# Altium project FMC_Delay_1ns_4Cha.PrjPcb (part 1 of 3)
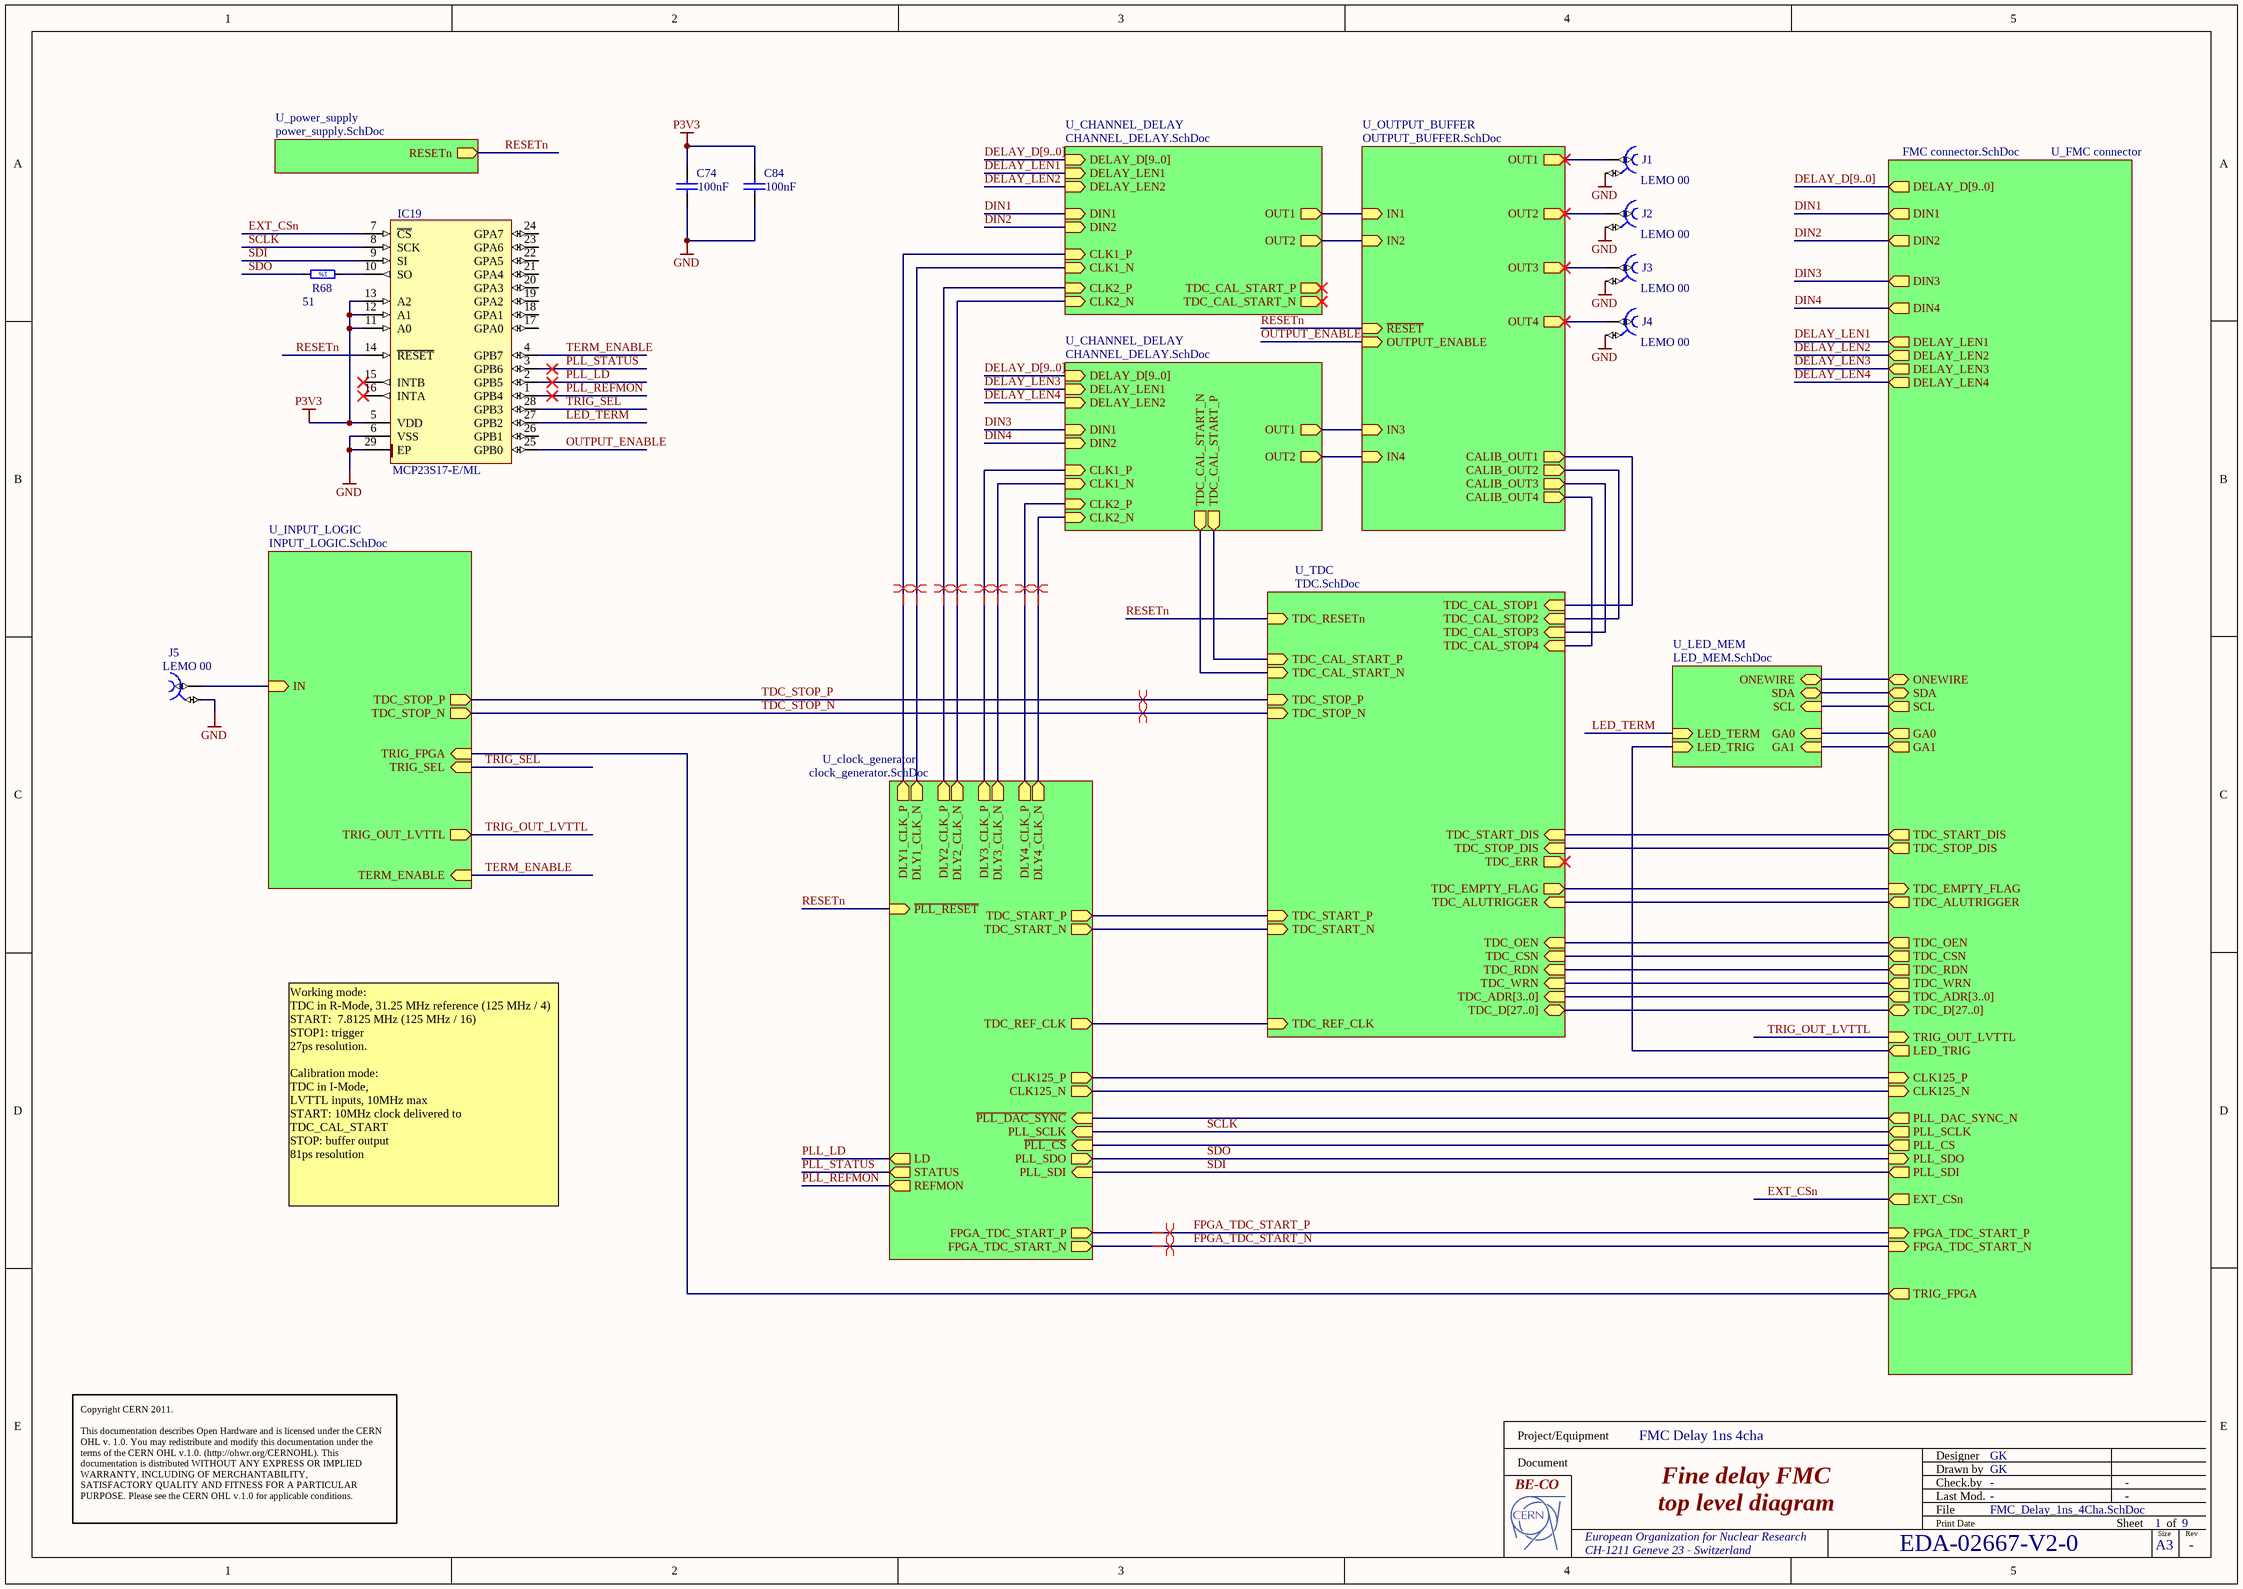
[diagram p0: FMC_Delay_1ns_4Cha.SchDoc]
9 sheets, 250 parts. Net scope: hierarchical (ports join the sheet entries above them; power ports are global).
Board file: FMC_Delay_1ns_4Cha.PcbDoc
Sheets:
  FMC_Delay_1ns_4Cha.SchDoc
    U_clock_generator = clock_generator.SchDoc
    U_FMC connector = FMC connector.SchDoc
    U_power_supply = power_supply.SchDoc
    U_TDC = TDC.SchDoc
    U_CHANNEL_DELAY = CHANNEL_DELAY.SchDoc
    U_CHANNEL_DELAY = CHANNEL_DELAY.SchDoc
    U_OUTPUT_BUFFER = OUTPUT_BUFFER.SchDoc
    U_INPUT_LOGIC = INPUT_LOGIC.SchDoc
    U_LED_MEM = LED_MEM.SchDoc

## Sheet FMC_Delay_1ns_4Cha.SchDoc: Fine delay FMC
size 420 x 297 mm; CheckedBy: -; CompanyName: CERN; DrawnBy: GK; Organization: CERN; Address1: European Organization for Nuclear Research; Address2: CH-1211 Geneve 23 - Switzerland; Revision: -; SheetNumber: 1; SheetTotal: 9; EDA_Number: EDA-02667-V2-0; Projet: FMC Delay 1ns 4cha; ModifiedBy: -; CheckedDate: -; Title2: top level diagram; DivGrp: BE-CO; Designer: GK; ModifiedDate: -; ProjectName: FMC Delay 1ns 4cha

### Parts
C74  100nF  [CAPC1608X87N]
C84  100nF  [CAPC1608X87N]
IC19  MCP23S17-E/ML  [QFN65P600X600X100-29N-S420]
J1  LEMO 00  [LEMO_EPL.00.250.NTN]
J2  LEMO 00  [LEMO_EPL.00.250.NTN]
J3  LEMO 00  [LEMO_EPL.00.250.NTN]
J4  LEMO 00  [LEMO_EPL.00.250.NTN]
J5  LEMO 00  [LEMO_EPL.00.250.NTN]
R68  51  [RESC1608X55N]

### Sub-sheets
U_CHANNEL_DELAY = CHANNEL_DELAY.SchDoc: DELAY_D[9..0] (in), DELAY_LEN1 (in), DELAY_LEN2 (in), DIN1 (in), DIN2 (in), OUT1 (out), OUT2 (out), TDC_CAL_START_P (out), TDC_CAL_START_N (out), CLK1_P (in), CLK1_N (in), CLK2_N (in), CLK2_P (in)
U_CHANNEL_DELAY = CHANNEL_DELAY.SchDoc: DELAY_D[9..0] (in), DELAY_LEN1 (in), DELAY_LEN2 (in), DIN1 (in), DIN2 (in), OUT1 (out), OUT2 (out), TDC_CAL_START_P (out), TDC_CAL_START_N (out), CLK1_P (in), CLK1_N (in), CLK2_N (in), CLK2_P (in)
U_clock_generator = clock_generator.SchDoc: PLL_SCLK (in), PLL_SDO (out), PLL_SDI (in), TDC_REF_CLK (out), CLK125_N (out), CLK125_P (out), LD (out), STATUS (out), REFMON (out), DLY1_CLK_P (out), DLY1_CLK_N (out), DLY2_CLK_P (out), DLY2_CLK_N (out), DLY3_CLK_P (out), DLY3_CLK_N (out), DLY4_CLK_P (out), DLY4_CLK_N (out), ~{PLL_CS} (in), ~{PLL_RESET} (in), ~{PLL_DAC_SYNC} (in), TDC_START_P (out), TDC_START_N (out), FPGA_TDC_START_N (out), FPGA_TDC_START_P (out)
U_FMC connector = FMC connector.SchDoc: DIN1 (out), DIN2 (out), DIN3 (out), DIN4 (out), TDC_START_DIS (out), TDC_STOP_DIS (out), TDC_EMPTY_FLAG (in), TDC_CSN (out), TDC_RDN (out), TDC_WRN (out), TDC_ADR[3..0] (out), TDC_D[27..0] (bidir), DELAY_LEN1 (out), DELAY_LEN2 (out), DELAY_LEN3 (out), DELAY_LEN4 (out), PLL_SCLK (out), PLL_CS (out), PLL_SDO (in), PLL_SDI (out), CLK125_P (in), CLK125_N (in), TRIG_OUT_LVTTL (in), DELAY_D[9..0] (out), TRIG_FPGA (out), SDA (bidir), SCL (out), GA0 (out), GA1 (out), EXT_CSn (out), PLL_DAC_SYNC_N (out), TDC_OEN (out), TDC_ALUTRIGGER (out), FPGA_TDC_START_N (in), FPGA_TDC_START_P (in), ONEWIRE (bidir), LED_TRIG (out)
U_INPUT_LOGIC = INPUT_LOGIC.SchDoc: IN (in), TERM_ENABLE (in), TRIG_OUT_LVTTL (out), TRIG_FPGA (in), TRIG_SEL (in), TDC_STOP_P (out), TDC_STOP_N (out)
U_LED_MEM = LED_MEM.SchDoc: SDA (bidir), SCL (in), GA0 (in), GA1 (in), ONEWIRE (bidir), LED_TERM (in), LED_TRIG (in)
U_OUTPUT_BUFFER = OUTPUT_BUFFER.SchDoc: IN1 (in), IN2 (in), IN3 (in), IN4 (in), OUT1 (out), OUT2 (out), OUT3 (out), OUT4 (out), ~{RESET} (in), CALIB_OUT1 (out), CALIB_OUT2 (out), CALIB_OUT3 (out), CALIB_OUT4 (out), OUTPUT_ENABLE (in)
U_power_supply = power_supply.SchDoc: RESETn (out)
U_TDC = TDC.SchDoc: TDC_ADR[3..0] (in), TDC_START_P (in), TDC_START_N (in), TDC_CAL_STOP1 (in), TDC_CAL_STOP2 (in), TDC_CAL_STOP3 (in), TDC_CAL_STOP4 (in), TDC_START_DIS (in), TDC_STOP_DIS (in), TDC_EMPTY_FLAG (out), TDC_REF_CLK (in), TDC_RESETn (in), TDC_D[27..0] (bidir), TDC_OEN (in), TDC_CSN (in), TDC_RDN (in), TDC_WRN (in), TDC_CAL_START_N (in), TDC_CAL_START_P (in), TDC_ERR (out), TDC_STOP_P (in), TDC_STOP_N (in), TDC_ALUTRIGGER (in)

### Nets
GND: C74.2 C84.2 IC19.6(VSS) IC19.29(EP) J1.2 J2.2 J3.2 J4.2 J5.2
P3V3: C74.1 C84.1 IC19.5(VDD) IC19.11(A0) IC19.12(A1) IC19.13(A2)
CLK1_N: sheet U_clock_generator/DLY1_CLK_N, sheet U_CHANNEL_DELAY/CLK1_N
CLK1_N: sheet U_clock_generator/DLY3_CLK_N, sheet U_CHANNEL_DELAY/CLK1_N  [a separate net that carries the same name]
CLK1_P: sheet U_clock_generator/DLY1_CLK_P, sheet U_CHANNEL_DELAY/CLK1_P
CLK1_P: sheet U_clock_generator/DLY3_CLK_P, sheet U_CHANNEL_DELAY/CLK1_P  [a separate net that carries the same name]
CLK2_N: sheet U_clock_generator/DLY2_CLK_N, sheet U_CHANNEL_DELAY/CLK2_N
CLK2_N: sheet U_clock_generator/DLY4_CLK_N, sheet U_CHANNEL_DELAY/CLK2_N  [a separate net that carries the same name]
CLK2_P: sheet U_clock_generator/DLY2_CLK_P, sheet U_CHANNEL_DELAY/CLK2_P
CLK2_P: sheet U_clock_generator/DLY4_CLK_P, sheet U_CHANNEL_DELAY/CLK2_P  [a separate net that carries the same name]
CLK125_N: sheet U_clock_generator/CLK125_N, sheet U_FMC connector/CLK125_N
CLK125_P: sheet U_clock_generator/CLK125_P, sheet U_FMC connector/CLK125_P
D1_N: sheet U_TDC/TDC_CAL_START_N, sheet U_CHANNEL_DELAY/TDC_CAL_START_N
D1_P: sheet U_TDC/TDC_CAL_START_P, sheet U_CHANNEL_DELAY/TDC_CAL_START_P
DELAY_LEN1: sheet U_FMC connector/DELAY_LEN1, sheet U_CHANNEL_DELAY/DELAY_LEN1
DELAY_LEN2: sheet U_FMC connector/DELAY_LEN2, sheet U_CHANNEL_DELAY/DELAY_LEN2
DELAY_LEN3: sheet U_FMC connector/DELAY_LEN3, sheet U_CHANNEL_DELAY/DELAY_LEN1
DELAY_LEN4: sheet U_FMC connector/DELAY_LEN4, sheet U_CHANNEL_DELAY/DELAY_LEN2
DIN1: sheet U_FMC connector/DIN1, sheet U_CHANNEL_DELAY/DIN1
DIN2: sheet U_FMC connector/DIN2, sheet U_CHANNEL_DELAY/DIN2
DIN3: sheet U_FMC connector/DIN3, sheet U_CHANNEL_DELAY/DIN1
DIN4: sheet U_FMC connector/DIN4, sheet U_CHANNEL_DELAY/DIN2
EXT_CSn: IC19.7(~{CS}) ; sheet U_FMC connector/EXT_CSn
FPGA_TDC_START_N: sheet U_clock_generator/FPGA_TDC_START_N, sheet U_FMC connector/FPGA_TDC_START_N
FPGA_TDC_START_P: sheet U_clock_generator/FPGA_TDC_START_P, sheet U_FMC connector/FPGA_TDC_START_P
GA0: sheet U_FMC connector/GA0, sheet U_LED_MEM/GA0
GA1: sheet U_FMC connector/GA1, sheet U_LED_MEM/GA1
LED_TERM: IC19.27(GPB2) ; sheet U_LED_MEM/LED_TERM
OUTPUT_ENABLE: IC19.25(GPB0) ; sheet U_OUTPUT_BUFFER/OUTPUT_ENABLE
PLL_LD: IC19.2(GPB5) ; sheet U_clock_generator/LD
PLL_REFMON: IC19.1(GPB4) ; sheet U_clock_generator/REFMON
PLL_STATUS: IC19.3(GPB6) ; sheet U_clock_generator/STATUS
RESETn: IC19.14(~{RESET}) ; sheet U_clock_generator/~{PLL_RESET}, sheet U_power_supply/RESETn, sheet U_TDC/TDC_RESETn, sheet U_OUTPUT_BUFFER/~{RESET}
SCL: sheet U_FMC connector/SCL, sheet U_LED_MEM/SCL
SCLK: IC19.8(SCK) ; sheet U_clock_generator/PLL_SCLK, sheet U_FMC connector/PLL_SCLK
SDA: sheet U_FMC connector/SDA, sheet U_LED_MEM/SDA
SDI: IC19.9(SI) ; sheet U_clock_generator/PLL_SDI, sheet U_FMC connector/PLL_SDI
SDO: R68.2 ; sheet U_clock_generator/PLL_SDO, sheet U_FMC connector/PLL_SDO
TDC_CAL_STOP1: sheet U_TDC/TDC_CAL_STOP1, sheet U_OUTPUT_BUFFER/CALIB_OUT1
TDC_CAL_STOP2: sheet U_TDC/TDC_CAL_STOP2, sheet U_OUTPUT_BUFFER/CALIB_OUT2
TDC_CAL_STOP3: sheet U_TDC/TDC_CAL_STOP3, sheet U_OUTPUT_BUFFER/CALIB_OUT3
TDC_CAL_STOP4: sheet U_TDC/TDC_CAL_STOP4, sheet U_OUTPUT_BUFFER/CALIB_OUT4
TDC_CSN: sheet U_FMC connector/TDC_CSN, sheet U_TDC/TDC_CSN
TDC_OEN: sheet U_FMC connector/TDC_OEN, sheet U_TDC/TDC_OEN
TDC_RDN: sheet U_FMC connector/TDC_RDN, sheet U_TDC/TDC_RDN
TDC_START_N: sheet U_clock_generator/TDC_START_P, sheet U_TDC/TDC_START_P
TDC_START_P: sheet U_clock_generator/TDC_START_N, sheet U_TDC/TDC_START_N
TDC_STOP_N: sheet U_TDC/TDC_STOP_N, sheet U_INPUT_LOGIC/TDC_STOP_N
TDC_STOP_P: sheet U_TDC/TDC_STOP_P, sheet U_INPUT_LOGIC/TDC_STOP_P
TDC_WRN: sheet U_FMC connector/TDC_WRN, sheet U_TDC/TDC_WRN
TERM_ENABLE: IC19.4(GPB7) ; sheet U_INPUT_LOGIC/TERM_ENABLE
TRIG_OUT_LVTTL: sheet U_FMC connector/TRIG_OUT_LVTTL, sheet U_INPUT_LOGIC/TRIG_OUT_LVTTL
TRIG_SEL: IC19.28(GPB3) ; sheet U_INPUT_LOGIC/TRIG_SEL
NetF1_2: J1.1 ; sheet U_OUTPUT_BUFFER/OUT1
NetF2_2: J2.1 ; sheet U_OUTPUT_BUFFER/OUT2
NetF3_2: J3.1 ; sheet U_OUTPUT_BUFFER/OUT3
NetF4_2: J4.1 ; sheet U_OUTPUT_BUFFER/OUT4
NetF5_1: J5.1 ; sheet U_INPUT_LOGIC/IN
NetIC1A_6: sheet U_CHANNEL_DELAY/OUT2, sheet U_OUTPUT_BUFFER/IN2
NetIC1A_7: sheet U_CHANNEL_DELAY/OUT1, sheet U_OUTPUT_BUFFER/IN1
NetIC1B_6: sheet U_CHANNEL_DELAY/OUT2, sheet U_OUTPUT_BUFFER/IN4
NetIC1B_7: sheet U_CHANNEL_DELAY/OUT1, sheet U_OUTPUT_BUFFER/IN3
NetIC4_17: sheet U_clock_generator/~{PLL_CS}, sheet U_FMC connector/PLL_CS
NetIC4_46: sheet U_clock_generator/TDC_REF_CLK, sheet U_TDC/TDC_REF_CLK
NetIC8_4: sheet U_FMC connector/TDC_START_DIS, sheet U_TDC/TDC_START_DIS
NetIC8_5: sheet U_FMC connector/TDC_STOP_DIS, sheet U_TDC/TDC_STOP_DIS
NetIC13_1: sheet U_FMC connector/ONEWIRE, sheet U_LED_MEM/ONEWIRE
NetIC14_5: sheet U_clock_generator/~{PLL_DAC_SYNC}, sheet U_FMC connector/PLL_DAC_SYNC_N
NetIC17_1: sheet U_FMC connector/TRIG_FPGA, sheet U_INPUT_LOGIC/TRIG_FPGA
NetIC19_10: IC19.10(SO) R68.1
NetJ6_g18: sheet U_FMC connector/TDC_ALUTRIGGER, sheet U_TDC/TDC_ALUTRIGGER
NetJ6_g19: sheet U_FMC connector/TDC_EMPTY_FLAG, sheet U_TDC/TDC_EMPTY_FLAG
NetT3_1: sheet U_FMC connector/LED_TRIG, sheet U_LED_MEM/LED_TRIG

Not connected (* = marked no-connect by the designer): IC19 15(INTB)* 16(INTA)* 17(GPA0) 18(GPA1) 19(GPA2) 20(GPA3) 21(GPA4) 22(GPA5) 23(GPA6) 24(GPA7) 26(GPB1)

### Buses and harness runs
bus DELAY_D[9..0] = sheet U_CHANNEL_DELAY/DELAY_D[9..0]
bus DELAY_D[9..0] = sheet U_FMC connector/DELAY_D[9..0]
bus sheet U_FMC connector/TDC_ADR[3..0] = sheet U_TDC/TDC_ADR[3..0]
bus sheet U_FMC connector/TDC_D[27..0] = sheet U_TDC/TDC_D[27..0]

### Layout directives
differential pair: CLK1_N, CLK1_P, CLK2_N, CLK2_P, FPGA_TDC_START_N, FPGA_TDC_START_P, TDC_STOP_N, TDC_STOP_P

### Notes on the sheet
- Working mode:
  TDC in R-Mode, 31.25 MHz reference (125 MHz / 4)
  START:  7.8125 MHz (125 MHz / 16)
  STOP1: trigger
  27ps resolution.
  Calibration mode:
  TDC in I-Mode,
  LVTTL inputs, 10MHz max
  START: 10MHz clock delivered to TDC_CAL_START
  STOP: buffer output
  81ps resolution
- Copyright CERN 2011.
  This documentation describes Open Hardware and is licensed under the CERN OHL v. 1.0. You may redistribute and modify this documentation under the terms of the CERN OHL v.1.0. (http://ohwr.org/CERNOHL). This documentation is distributed WITHOUT ANY EXPRESS OR IMPLIED WARRANTY, INCLUDING OF MERCHANTABILITY, SATISFACTORY QUALITY AND FITNESS FOR A PARTICULAR PURPOSE. Please see the CERN OHL v.1.0 for applicable conditions.
- Project/Equipment
- Document
- Designer
- Drawn by
- Check.by
- File
- Last Mod.
- Print Date
- Sheet
- Size
- A3
- of
- Rev
- (in symbol R0603_51R_1%_0.1W_100PPM) 1%

### Library data of the parts
C74 C84 = CC0603_100NF_50V_10%_X7R: Non-polarised capacitor; Manufacturer1 Part Number: 223858615649; Manufacturer: GENERIC; Part Description: SMD Multilayer Chip Ceramic Capacitor; Table: Capacitors SMD; TC: X7R; Tolerance: ±10%; Voltage: 50V; Author: CERN DEM JLC; Case: 0603; Component Type: Standard; CreateDate: 12/3/2007; HelpURL: \\cern.ch\dfs\Applications\Altium\Datasheets\CC0603_X7R_PHYCOMP.pdf; LatestRevisionDate: 12/3/2007; Manufacturer1 ComponentHeight: 0.87mm; Manufacturer1 Example: PHYCOMP; Manufacturer Part Number: CC0603_100NF_50V_10%_X7R; Mounted: Yes; Pin Count: 2; SMD: Yes; Socket: No; Status: Preferred; Value: 100nF; Part Number: CC0603_100NF_50V_10%_X7R; Component Kind: Standard
IC19 = MCP23S17-E/ML: 16-bit I/O Port Expander With Serial Interface; Manufacturer: MICROCHIP TECHNOLOGY; Table: Analog & Interface; Part Number: MCP23S17-E/ML; Component Kind: Standard; Component Type: Standard; Device: MCP23S17-E/ML; PackageDescription: QFN, 0.65mm pitch, square; 28 pin, 6.00mm L X 6.00mm W X 1.00mm H body (w/thermal tab 4.2mm x 4.2mm), IPC Medium Density; Part Description: 16-bit I/O Port Expander With Serial Interface; Manufacturer Part Number: MCP23S17-E/ML; Pin Count: 29; Case: QFN28; Mounted: Yes; Socket: No; SMD: Yes; ComponentHeight: 1mm; Author: CERN DEM JLC; HelpURL: \\cern.ch\dfs\Applications\Altium\Datasheets\MCP23S17-E-ML.pdf; CreateDate: 5/11/2010; LatestRevisionDate: 5/11/2010
J1-J5 = LEMO_EPL.00.250.NTN: Part Description: Size 00, 50 Ohms Coaxial Elbow (90°) socket; SCEM: 09.46.11.180.6; Part Number: LEMO_EPL.00.250.NTN; Component Kind: Standard; Component Type: Standard; Pin Count: 2; Family: LEMO 00; Mounted: Yes; Socket: No; SMD: No; Status: None; Manufacturer: LEMO; Manufacturer Part Number: EPL.00.250.NTN; ComponentHeight: 7mm; HelpURL: \\cern.ch\dfs\Applications\Altium\Datasheets\LEMO_EPL.00.250.NTN.pdf; Author: CERN DEM JLC; CreateDate: 12/3/2007; LatestRevisionDate: 3/13/2008; Table: LEMO
R68 = R0603_51R_1%_0.1W_100PPM: Resistor - 1%; Part Description: General Purpose Thick Film Chip Resistor; Manufacturer: GENERIC; Manufacturer1 Part Number: NRC06F51R0TRF; Power: 0.1W; TC: ±100ppm/°C; Table: Resistors SMD; Part Number: R0603_51R_1%_0.1W_100PPM; Component Kind: Standard; Component Type: Standard; Pin Count: 2; Value: 51; Status: Preferred; Tolerance: ±1%; Manufacturer Part Number: R0603_51R_1%_0.1W_100PPM; Case: 0603; Mounted: Yes; Socket: No; SMD: Yes; Manufacturer1 Example: NIC COMPONENT; Manufacturer1 ComponentHeight: 0.55mm; HelpURL: \\cern.ch\dfs\Applications\Altium\Datasheets\R0603_NIC_NRC.pdf; Author: CERN DEM JLC; CreateDate: 12/3/2007; LatestRevisionDate: 3/13/2008

## Sheet clock_generator.SchDoc: PLL & clock distribution
size 297 x 209 mm; CheckedBy: -; Author: T.W.; CompanyName: CERN; DrawnBy: GK, TW; Organization: CERN; Address1: European Organization for Nuclear Research; Address2: CH-1211 Geneve 23 - Switzerland; DocumentNumber: 5; Revision: -; SheetNumber: 2; SheetTotal: 9; EDA_Number: EDA-02667-V2-0; Projet: FMC Delay 1ns 4cha; ModifiedBy: -; CheckedDate: -; DivGrp: BE-CO; Designer: TW, GK; ModifiedDate: -
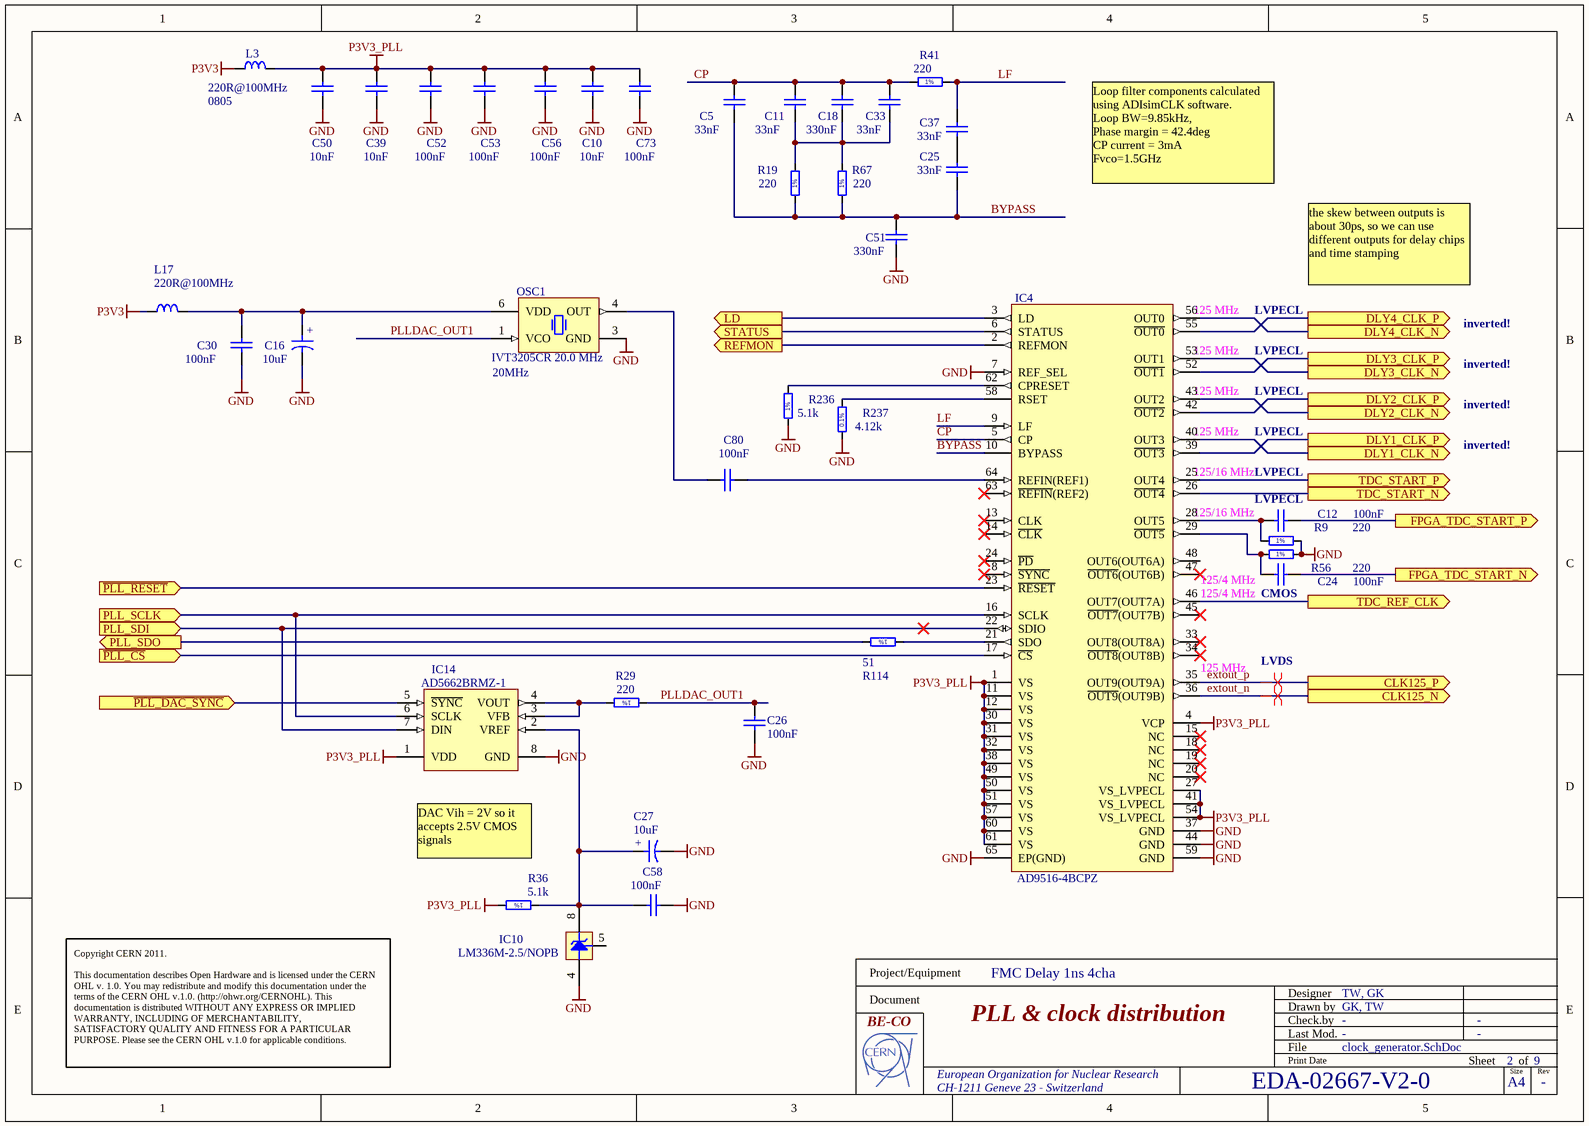
[diagram p1: clock_generator.SchDoc]

### Parts
(Parts that share a designator on the sheet are numbered #1, #2 ... from top to bottom, then left to right.)
C5  33nF  [CAPC1608X87N]
C10  10nF  [CAPC1608X87N]
C11  33nF  [CAPC1608X87N]
C12  100nF  [CAPC1608X87N]
C16  10uF  [CAPMP3216X180N]
C18  330nF  [CAPC1608X87N]
C24  100nF  [CAPC1608X87N]
C25  33nF  [CAPC1608X87N]
C26  100nF  [CAPC1608X87N]
C27  10uF  [CAPMP3216X180N]
C30  100nF  [CAPC1608X87N]
C33  33nF  [CAPC1608X87N]
C37  33nF  [CAPC1608X87N]
C39  10nF  [CAPC1608X87N]
C50  10nF  [CAPC1608X87N]
C51  330nF  [CAPC1608X87N]
C52  100nF  [CAPC1608X87N]
C53  100nF  [CAPC1608X87N]
C56  100nF  [CAPC1608X87N]
C58  100nF  [CAPC1608X87N]
C73  100nF  [CAPC1608X87N]
C80  100nF  [CAPC1608X87N]
IC4  AD9516-4BCPZ  [QFN50P900X900X100-65N-S635]
IC10  LM336M-2.5/NOPB  [SOIC127P600X175-8N]
IC14  AD5662BRMZ-1  [SOP65P490X110-8N]
L3  220R@100MHz  Case: 0805  [INDC2012X105N]
L17  220R@100MHz  [INDC2012X105N]
OSC1  20MHz  Manufacturer Part Number: IVT3205CR 20.0 MHz  [OSC_RAKON_IVT3200C]
R9  220  [RESC1608X55N]
R19  220  [RESC1608X55N]
R29#1  220  [RESC1608X55N]
R36  5.1k  [RESC1608X55N]
R41  220  [RESC1608X55N]
R56  220  [RESC1608X55N]
R67  220  [RESC1608X55N]
R114  51  [RESC1608X55N]
R236  5.1k  [RESC1608X55N]
R237  4.12k  [RESC1608X55N]

### Ports
CLK125_N (out), CLK125_P (out), DLY1_CLK_N (out), DLY1_CLK_P (out), DLY2_CLK_N (out), DLY2_CLK_P (out), DLY3_CLK_N (out), DLY3_CLK_P (out), DLY4_CLK_N (out), DLY4_CLK_P (out), FPGA_TDC_START_N (out), FPGA_TDC_START_P (out), LD (out), PLL_SCLK (in), PLL_SDI (in), PLL_SDO (out), REFMON (out), STATUS (out), TDC_REF_CLK (out), TDC_START_N (out), TDC_START_P (out), ~{PLL_CS} (in), ~{PLL_DAC_SYNC} (in), ~{PLL_RESET} (in)

### Nets
GND: C10.2 C16.2 C26.2 C27.2 C30.1 C39.2 C50.2 C51.1 C52.1 C53.1 C56.1 C58.1 C73.1 IC4.7(REF_SEL) IC4.37(GND) IC4.44(GND) IC4.59(GND) IC4.65(EP(GND)) IC10.4(A) IC14.8(GND) OSC1.3(GND) R9.2 R56.2 R236.1 R237.1
P3V3: L3.1 L17.1
P3V3_PLL: C10.1 C39.1 C50.1 C52.2 C53.2 C56.2 C73.2 IC4.1(VS) IC4.4(VCP) IC4.11(VS) IC4.12(VS) IC4.27(VS_LVPECL) IC4.30(VS) IC4.31(VS) IC4.32(VS) IC4.38(VS) IC4.41(VS_LVPECL) IC4.49(VS) IC4.50(VS) IC4.51(VS) IC4.54(VS_LVPECL) IC4.57(VS) IC4.60(VS) IC4.61(VS) IC14.1(VDD) L3.2 R36.2
BYPASS: C5.1 C25.1 C51.2 IC4.10(BYPASS) R19.1 R67.1
CLK1_N: IC4.40(OUT3) ; port DLY1_CLK_N
CLK1_N: IC4.53(OUT1) ; port DLY3_CLK_N  [a separate net that carries the same name]
CLK1_P: IC4.39(~{OUT3}) ; port DLY1_CLK_P
CLK1_P: IC4.52(~{OUT1}) ; port DLY3_CLK_P  [a separate net that carries the same name]
CLK2_N: IC4.43(OUT2) ; port DLY2_CLK_N
CLK2_N: IC4.56(OUT0) ; port DLY4_CLK_N  [a separate net that carries the same name]
CLK2_P: IC4.42(~{OUT2}) ; port DLY2_CLK_P
CLK2_P: IC4.55(~{OUT0}) ; port DLY4_CLK_P  [a separate net that carries the same name]
CP: C5.2 C11.2 C18.2 C33.2 IC4.5(CP) R41.1
extout_n: IC4.36(~{OUT9}(OUT9B)) ; port CLK125_N  [project net CLK125_N]
extout_p: IC4.35(OUT9(OUT9A)) ; port CLK125_P  [project net CLK125_P]
FPGA_TDC_START_N: C24.1 ; port FPGA_TDC_START_N
FPGA_TDC_START_P: C12.1 ; port FPGA_TDC_START_P
LF: C37.2 IC4.9(LF) R41.2
PLL_LD: IC4.3(LD) ; port LD
PLL_REFMON: IC4.2(REFMON) ; port REFMON
PLL_STATUS: IC4.6(STATUS) ; port STATUS
PLLDAC_OUT1: C26.1 OSC1.1(VCO) R29#1.1
RESETn: IC4.23(~{RESET}) ; port ~{PLL_RESET}
SCLK: IC4.16(SCLK) IC14.6(SCLK) ; port PLL_SCLK
SDI: IC4.22(SDIO) IC14.7(DIN) ; port PLL_SDI
SDO: R114.2 ; port PLL_SDO
TDC_START_N: IC4.25(OUT4) ; port TDC_START_P
TDC_START_P: IC4.26(~{OUT4}) ; port TDC_START_N
NetC11_1: C11.1 C18.1 C33.1 R19.2 R67.2
NetC12_2: C12.2 IC4.28(OUT5) R9.1
NetC16_1: C16.1 C30.2 L17.2 OSC1.6(VDD)
NetC24_2: C24.2 IC4.29(~{OUT5}) R56.1
NetC25_2: C25.2 C37.1
NetC27_1: C27.1 C58.2 IC10.8(C) IC14.2(VREF) R36.1
NetC80_1: C80.1 IC4.64(REFIN(REF1))
NetC80_2: C80.2 OSC1.4(OUT)
NetIC4_17: IC4.17(~{CS}) ; port ~{PLL_CS}
NetIC4_21: IC4.21(SDO) R114.1
NetIC4_46: IC4.46(OUT7(OUT7A)) ; port TDC_REF_CLK
NetIC4_58: IC4.58(RSET) R237.2
NetIC4_62: IC4.62(CPRESET) R236.2
NetIC14_3: IC14.3(VFB) IC14.4(VOUT) R29#1.2
NetIC14_5: IC14.5(~{SYNC}) ; port ~{PLL_DAC_SYNC}

Not connected (* = marked no-connect by the designer): IC4 8(~{SYNC})* 13(CLK)* 14(~{CLK})* 15(NC)* 18(NC)* 19(NC)* 20(NC)* 24(~{PD})* 33(OUT8(OUT8A))* 34(~{OUT8}(OUT8B))* 45(~{OUT7}(OUT7B))* 47(~{OUT6}(OUT6B))* 48(OUT6(OUT6A)) 63(~{REFIN}(REF2))*; IC10 5(Adj)

### Layout directives
differential pair: CLK125_N, CLK125_P

### Notes on the sheet
- Loop filter components calculated using ADIsimCLK software.
  Loop BW=9.85kHz,
  Phase margin = 42.4deg
  CP current = 3mA
  Fvco=1.5GHz
- (near IC4) 125 MHz
- LVPECL
- the skew between outputs is about 30ps, so we can use different outputs for delay chips and time stamping
- inverted!
- (near IC4) 125/16 MHz
- 125/16 MHz
- (near C12) LVPECL
- 125/4 MHz
- (near C24) CMOS
- LVDS
- DAC Vih = 2V so it accepts 2.5V CMOS signals
- Copyright CERN 2011.
  This documentation describes Open Hardware and is licensed under the CERN OHL v. 1.0. You may redistribute and modify this documentation under the terms of the CERN OHL v.1.0. (http://ohwr.org/CERNOHL). This documentation is distributed WITHOUT ANY EXPRESS OR IMPLIED WARRANTY, INCLUDING OF MERCHANTABILITY, SATISFACTORY QUALITY AND FITNESS FOR A PARTICULAR PURPOSE. Please see the CERN OHL v.1.0 for applicable conditions.
- Project/Equipment
- Document
- Designer
- Drawn by
- Check.by
- File
- Last Mod.
- Print Date
- Sheet
- Size
- A4
- of
- Rev
- (in symbol CTE3216-18_10UF_10V_10%_LESR1800) +
- (in symbol R0603_4K12_0.1%_0.063W_10PPM) 0.1%
- (in symbol R0603_5K1_1%_0.1W_100PPM) 1%
- (in symbol R0603_51R_1%_0.1W_100PPM) 1%
- (in symbol R0603_220R_1%_0.1W_100PPM) 1%

### Library data of the parts
C5 C11 C25 C33 C37 = CC0603_33NF_25V_10%_X7R: Non-polarised capacitor; Part Description: SMD Multilayer Chip Ceramic Capacitor; Manufacturer: GENERIC; Manufacturer1 Part Number: 223891615643; Voltage: 25V; TC: X7R; Tolerance: ±10%; Table: Capacitors SMD; Part Number: CC0603_33NF_25V_10%_X7R; Component Kind: Standard; Component Type: Standard; Pin Count: 2; Value: 33nF; Status: Preferred; Manufacturer Part Number: CC0603_33NF_25V_10%_X7R; Case: 0603; Mounted: Yes; Socket: No; SMD: Yes; Manufacturer1 Example: PHYCOMP; Manufacturer1 ComponentHeight: 0.87mm; HelpURL: \\cern.ch\dfs\Applications\Altium\Datasheets\CC0603_X7R_PHYCOMP.pdf; Author: CERN DEM JLC; CreateDate: 12/3/2007; LatestRevisionDate: 12/3/2007
C10 C39 C50 = CC0603_10NF_50V_10%_X7R: Non-polarised capacitor; Part Description: SMD Multilayer Chip Ceramic Capacitor; Manufacturer: GENERIC; Manufacturer1 Part Number: 223858615636; Voltage: 50V; TC: X7R; Tolerance: ±10%; Table: Capacitors SMD; Part Number: CC0603_10NF_50V_10%_X7R; Component Kind: Standard; Component Type: Standard; Pin Count: 2; Value: 10nF; Status: Preferred; Manufacturer Part Number: CC0603_10NF_50V_10%_X7R; Case: 0603; Mounted: Yes; Socket: No; SMD: Yes; Manufacturer1 Example: PHYCOMP; Manufacturer1 ComponentHeight: 0.87mm; HelpURL: \\cern.ch\dfs\Applications\Altium\Datasheets\CC0603_X7R_PHYCOMP.pdf; Author: CERN DEM JLC; CreateDate: 12/3/2007; LatestRevisionDate: 12/3/2007
C12 C24 C26 C52 C53 C56 C58 C73 = CC0603_100NF_50V_10%_X7R: Non-polarised capacitor; Part Description: SMD Multilayer Chip Ceramic Capacitor; Manufacturer: GENERIC; Manufacturer1 Part Number: 223858615649; Voltage: 50V; TC: X7R; Tolerance: ±10%; Table: Capacitors SMD; Part Number: CC0603_100NF_50V_10%_X7R; Component Kind: Standard; Component Type: Standard; Pin Count: 2; Value: 100nF; Status: Preferred; Manufacturer Part Number: CC0603_100NF_50V_10%_X7R; Case: 0603; Mounted: Yes; Socket: No; SMD: Yes; Manufacturer1 Example: PHYCOMP; Manufacturer1 ComponentHeight: 0.87mm; HelpURL: \\cern.ch\dfs\Applications\Altium\Datasheets\CC0603_X7R_PHYCOMP.pdf; Author: CERN DEM JLC; CreateDate: 12/3/2007; LatestRevisionDate: 12/3/2007
  C26 C58: Designator: Capacitor - non polarized; Library Reference: Capacitor - non polarized
C16 C27 = CTE3216-18_10UF_10V_10%_LESR1800: Polarised capacitor; Part Description: Low ESR 1R8 Solid Tantalum Chip Capacitor; Manufacturer: GENERIC; Manufacturer1 Part Number: TPSA106K010R1800; Voltage: 10V; Tolerance: ±10%; Table: Capacitors SMD; Part Number: CTE3216-18_10UF_10V_10%_LESR1800; Component Kind: Standard; Component Type: Standard; Pin Count: 2; Value: 10uF; Status: Preferred; Manufacturer Part Number: CTE3216-18_10UF_10V_10%_LESR1800; Case: A; Mounted: Yes; Socket: No; SMD: Yes; Manufacturer1 Example: AVX; Manufacturer1 ComponentHeight: 1.8mm; HelpURL: \\cern.ch\dfs\Applications\Altium\Datasheets\CTE-LESR_AVX_TPS.pdf; Author: CERN DEM JLC; CreateDate: 5/5/2008; LatestRevisionDate: 1/20/2009
C18 C51 = CC0603_330NF_16V_10%_X5R: Non-polarised capacitor; Part Description: SMD Multilayer Chip Ceramic Capacitor; Manufacturer: GENERIC; Manufacturer1 Part Number: 223878613656; Voltage: 16V; TC: X5R; Tolerance: ±10%; Table: Capacitors SMD; Part Number: CC0603_330NF_16V_10%_X5R; Component Kind: Standard; Component Type: Standard; Pin Count: 2; Value: 330nF; Status: Preferred; Manufacturer Part Number: CC0603_330NF_16V_10%_X5R; Case: 0603; Mounted: Yes; Socket: No; SMD: Yes; Manufacturer1 Example: PHYCOMP; Manufacturer1 ComponentHeight: 0.87mm; HelpURL: \\cern.ch\dfs\Applications\Altium\Datasheets\CC0805_X5R_PHYCOMP_HC.pdf; Author: CERN DEM JLC; CreateDate: 12/3/2007; LatestRevisionDate: 12/3/2007
C30 C80 = CC0603_100NF_50V_10%_X7R: as C74 on sheet FMC_Delay_1ns_4Cha; Author: CERN DEM JLC; Case: 0603; Component Type: Standard; CreateDate: 12/3/2007; HelpURL: \\cern.ch\dfs\Applications\Altium\Datasheets\CC0603_X7R_PHYCOMP.pdf; LatestRevisionDate: 12/3/2007; Manufacturer1 ComponentHeight: 0.87mm; Manufacturer1 Example: PHYCOMP; Manufacturer Part Number: CC0603_100NF_50V_10%_X7R; Mounted: Yes; Pin Count: 2; SMD: Yes; Socket: No; Status: Preferred; Value: 100nF; Part Number: CC0603_100NF_50V_10%_X7R; Component Kind: Standard
IC4 = AD9516-4BCPZ: 14-Output Clock Generator with Integrated 1.6 GHz VCO; Manufacturer: ANALOG DEVICES; Table: Logic; Part Number: AD9516-4BCPZ; Component Kind: Standard; Component Type: Standard; Device: AD9516-4BCPZ; PackageDescription: QFN,0.50mm pitch,square;64 pin,9.00mm L X 9.00mm W X 1.00mm H body (6.35mm X 6.35mm thermal tab), IPC Medium Density; Part Description: 14-Output Clock Generator with Integrated 1.6 GHz VCO; Manufacturer Part Number: AD9516-4BCPZ; Pin Count: 65; Case: QFN64; Mounted: Yes; Socket: No; SMD: Yes; ComponentHeight: 1.0mm; HelpURL: \\cern.ch\dfs\Applications\Altium\Datasheets\AD9516-4BCPZ.pdf; Author: CERN DEM JLC; CreateDate: 1/18/2010; LatestRevisionDate: 1/18/2010
IC10 = LM336M-2.5/NOPB: Reference Diode; Part Description: 2.5V Voltage Reference Diode; Manufacturer: NATIONAL SEMICONDUCTOR; Table: Regulators; Part Number: LM336M-2.5/NOPB; Component Kind: Standard; Component Type: Standard; Device: LM336M-2.5/NOPB; PackageDescription: SOIC 8, Pitch 1.27mm - Body 4x5mm, IPC Medium Density; Manufacturer Part Number: LM336M-2.5/NOPB; Pin Count: 3; Case: SOIC8; Mounted: Yes; Socket: No; SMD: Yes; ComponentHeight: 1.75mm; HelpURL: \\cern.ch\dfs\Applications\Altium\Datasheets\LM336M-2.5-NOPB.pdf; Author: CERN DEM JLC; CreateDate: 4/12/2010; LatestRevisionDate: 4/12/2010
IC14 = AD5662BRMZ-1: 2.7V to 5.5V, 250uA, Rail-to-Rail Output 16-Bit nanoDAC; Manufacturer: ANALOG DEVICES; Table: Analog & Interface; Part Number: AD5662BRMZ-1; Component Kind: Standard; Component Type: Standard; Device: AD5662BRMZ-1; PackageDescription: SOP, 8-Leads, Body 3.0x3.0mm, Pitch 0.65mm, IPC Medium Density; Part Description: 2.7V to 5.5V, 250uA, Rail-to-Rail Output 16-Bit nanoDAC; Manufacturer Part Number: AD5662BRMZ-1; Pin Count: 8; Case: MSOP8; Mounted: Yes; Socket: No; SMD: Yes; ComponentHeight: 1.1mm; Author: CERN DEM JLC; HelpURL: \\cern.ch\dfs\Applications\Altium\Datasheets\AD5662BRMZ-1.pdf; CreateDate: 1/10/2011; LatestRevisionDate: 1/10/2011
L3 L17 = IND0805_MURATA_BLM21PG221SN1D: Inductor; Part Description: SMD EMIFIL Suppression Chip Bead Ferrite; Manufacturer: MURATA; Power: 2A; Resistance: 0.05R; Tolerance: ±25%; Table: Inductors SMD; Part Number: IND0805_MURATA_BLM21PG221SN1D; Component Kind: Standard; Component Type: Standard; Pin Count: 2; Value: 220R@100MHz; Status: None; Manufacturer Part Number: BLM21PG221SN1D; Mounted: Yes; Socket: No; SMD: Yes; ComponentHeight: 1.05mm; HelpURL: \\cern.ch\dfs\Applications\Altium\Datasheets\IND0402_MURATA_BLM21P.pdf; Author: CERN DEM JLC; CreateDate: 1/25/2010; LatestRevisionDate: 1/25/2010
  L17: Case: 0805
OSC1 = OSC_20MHZ_RAKON_IVT3205CR: Oscillator 4 pins 1=VCO 3=GND 4=OUT 6=VDC; Part Description: 11pF 3.3V ±1ppm Surface Mount TCXO Voltage Controlled Oscillator (IT3200C Serie); Manufacturer: RAKON; Table: Crystals & Oscillators; Part Number: OSC_20MHZ_RAKON_IVT3205CR; Component Kind: Standard; Component Type: Standard; PackageDescription: Oscillator IVT3200C Serie, corner concave; 4 pin, 2.50mm L X 3.2mm W X 1.1mm H; Value: 20MHz; Pin Count: 4; Mounted: Yes; Socket: No; SMD: Yes; ComponentHeight: 1.1mm; HelpURL: \\cern.ch\dfs\Applications\Altium\Datasheets\OSC_RAKON_IVT3205CR 20MHZ.pdf; Author: CERN DEM JLC; CreateDate: 3/24/2011; LatestRevisionDate: 3/24/2011
R9 R19 R29#1 R41 R56 R67 = R0603_220R_1%_0.1W_100PPM: Resistor - 1%; Part Description: General Purpose Thick Film Chip Resistor; Manufacturer: GENERIC; Manufacturer1 Part Number: NRC06F2200TRF; Power: 0.1W; TC: ±100ppm/°C; Table: Resistors SMD; Part Number: R0603_220R_1%_0.1W_100PPM; Component Kind: Standard; Component Type: Standard; Pin Count: 2; Value: 220; Status: Preferred; Tolerance: ±1%; Manufacturer Part Number: R0603_220R_1%_0.1W_100PPM; Case: 0603; Mounted: Yes; Socket: No; SMD: Yes; Manufacturer1 Example: NIC COMPONENT; Manufacturer1 ComponentHeight: 0.55mm; HelpURL: \\cern.ch\dfs\Applications\Altium\Datasheets\R0603_NIC_NRC.pdf; Author: CERN DEM JLC; CreateDate: 12/3/2007; LatestRevisionDate: 3/13/2008
R36 R236 = R0603_5K1_1%_0.1W_100PPM: Resistor - 1%; Part Description: General Purpose Thick Film Chip Resistor; Manufacturer: GENERIC; Manufacturer1 Part Number: NRC06F5101TRF; Value: 5k1; Power: 0.1W; TC: ±100ppm/°C; Table: Resistors SMD; Part Number: R0603_5K1_1%_0.1W_100PPM; Component Kind: Standard; Component Type: Standard; Designator: Resistor - 1%; Library Reference: Resistor - 1%; Pin Count: 2; Status: Preferred; Tolerance: ±1%; Manufacturer Part Number: R0603_5K1_1%_0.1W_100PPM; Case: 0603; Mounted: Yes; Socket: No; SMD: Yes; Manufacturer1 Example: NIC COMPONENT; Manufacturer1 ComponentHeight: 0.55mm; HelpURL: \\cern.ch\dfs\Applications\Altium\Datasheets\R0603_NIC_NRC.pdf; Author: CERN DEM JLC; CreateDate: 12/3/2007; LatestRevisionDate: 3/13/2008
R114 = R0603_51R_1%_0.1W_100PPM: as R68 on sheet FMC_Delay_1ns_4Cha; Part Number: R0603_51R_1%_0.1W_100PPM; Component Kind: Standard; Component Type: Standard; Pin Count: 2; Value: 51; Status: Preferred; Tolerance: ±1%; Manufacturer Part Number: R0603_51R_1%_0.1W_100PPM; Case: 0603; Mounted: Yes; Socket: No; SMD: Yes; Manufacturer1 Example: NIC COMPONENT; Manufacturer1 ComponentHeight: 0.55mm; HelpURL: \\cern.ch\dfs\Applications\Altium\Datasheets\R0603_NIC_NRC.pdf; Author: CERN DEM JLC; CreateDate: 12/3/2007; LatestRevisionDate: 3/13/2008
R237 = R0603_4K12_0.1%_0.063W_10PPM: Resistor - 0.1%; Part Description: Thin Film Chip Resistor; Manufacturer: GENERIC; Manufacturer1 Part Number: RN73C1J4K12BTDF; Value: 4k12; Power: 0.063W; TC: ±10ppm; Table: Resistors SMD; Part Number: R0603_4K12_0.1%_0.063W_10PPM; Component Kind: Standard; Component Type: Standard; Designator: Resistor - 0.1%; Library Reference: Resistor - 0.1%; Pin Count: 2; Status: Not recommended; Tolerance: ±0.1%; Manufacturer Part Number: R0603_4K12_0.1%_0.063W_10PPM; Case: 0603; Mounted: Yes; Socket: No; SMD: Yes; Manufacturer1 Example: TYCO HOLSWORTHY; Manufacturer1 ComponentHeight: 0.5mm; HelpURL: \\cern.ch\dfs\Applications\Altium\Datasheets\R0603_Tyco_RN73.pdf; Author: CERN DEM JLC; CreateDate: 12/3/2007; LatestRevisionDate: 3/13/2008

## Sheet FMC connector.SchDoc: FMC Connector
size 420 x 297 mm; CheckedBy: M.C., T.W.,  E.B.; CompanyName: CERN; DrawnBy: Greg Kasprowicz; Organization: CERN; Address1: European Organization for Nuclear Research; Address2: CH-1211 Geneve 23 - SwitzerLA_Pd; DocumentNumber: 3; Revision: -; SheetNumber: 3; SheetTotal: 9; EDA_Number: EDA-XXXXX-XX-X; Projet: FMC Delay 1ns 4cha; ModifiedBy: -; CreateDate: 10/07/2010; CheckedDate: -; DivGrp: BE-CO; Designer: Greg Kasprowicz,; PageSetup: Record=PageOptions|CenterHorizontal=True|CenterVertical=True|PrintScale=0.96|XCorrection=1.00|YCorrection=1.00|PrintKind=1|BorderSize=5000000|LeftOffset=0|BottomOffset=0|Orientation=2|PaperLength=1000|PaperWidth=1000|Scale=100|PaperSource=15|PrintQuality=600|MediaType=1|DitherType=10|PaperKind=A3|PrintScaleMode=1; ModifiedDate: -
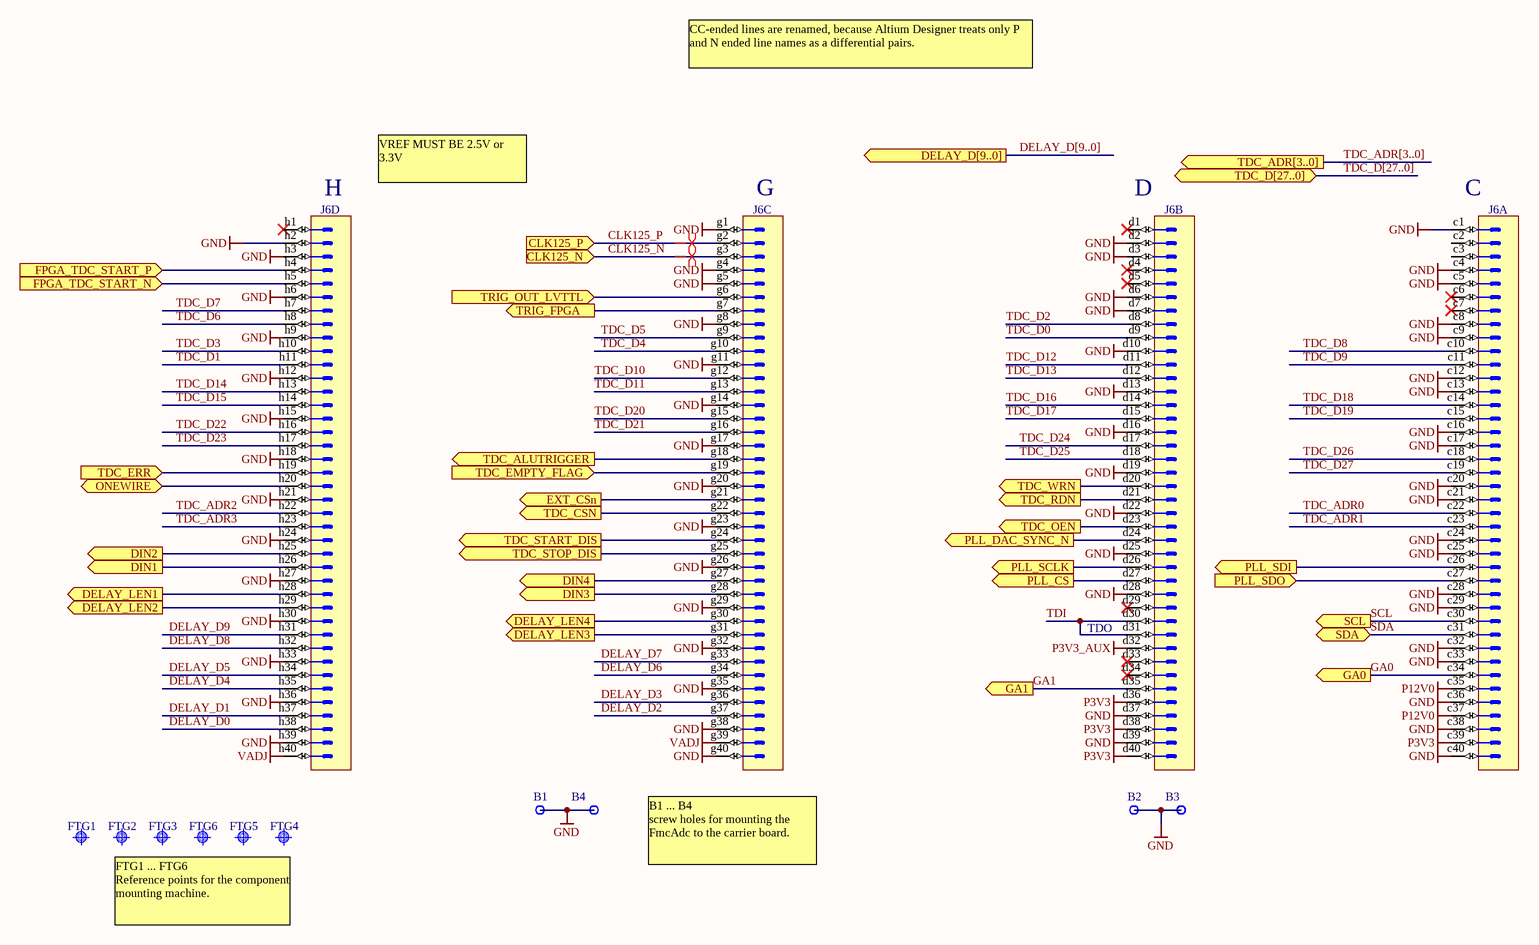
[diagram p2: FMC connector.SchDoc]

### Parts
B1  Plated Hole  [MTG300_600]  (value not drawn)
B2  Plated Hole  [MTG300_600]  (value not drawn)
B3  Plated Hole  [MTG300_600]  (value not drawn)
B4  Plated Hole  [MTG300_600]  (value not drawn)
FTG1  Use only in PCB  [FIDUCIAL_TOP_S100-200]  (value not drawn)
FTG2  Use only in PCB  [FIDUCIAL_TOP_S100-200]  (value not drawn)
FTG3  Use only in PCB  [FIDUCIAL_TOP_S100-200]  (value not drawn)
FTG4  Use only in PCB  [FIDUCIAL_TOP_S100-200]  (value not drawn)
FTG5  Use only in PCB  [FIDUCIAL_TOP_S100-200]  (value not drawn)
FTG6  Use only in PCB  [FIDUCIAL_TOP_S100-200]  (value not drawn)
J6  VITA 57  [SAMTEC_ASP-127797-01]  (value not drawn)  (parts A,B,C,D of 4)

### Ports
CLK125_N (in), CLK125_P (in), DELAY_D[9..0] (out), DELAY_LEN1 (out), DELAY_LEN2 (out), DELAY_LEN3 (out), DELAY_LEN4 (out), DIN1 (out), DIN2 (out), DIN3 (out), DIN4 (out), EXT_CSn (out), FPGA_TDC_START_N (in), FPGA_TDC_START_P (in), GA0 (out), GA1 (out), ONEWIRE (bidir), PLL_CS (out), PLL_DAC_SYNC_N (out), PLL_SCLK (out), PLL_SDI (out), PLL_SDO (in), SCL (out), SDA (bidir), TDC_ADR[3..0] (out), TDC_ALUTRIGGER (out), TDC_CSN (out), TDC_D[27..0] (bidir), TDC_EMPTY_FLAG (in), TDC_ERR (in), TDC_OEN (out), TDC_RDN (out), TDC_START_DIS (out), TDC_STOP_DIS (out), TDC_WRN (out), TRIG_FPGA (out), TRIG_OUT_LVTTL (in)

### Nets
GND: B1.1 B2.1 B3.1 B4.1 J6.c1 J6.c4 J6.c5 J6.c8 J6.c9 J6.c12 J6.c13 J6.c16 J6.c17 J6.c20 J6.c21 J6.c24 J6.c25 J6.c28 J6.c29 J6.c32 J6.c33 J6.c36 J6.c38 J6.c40 J6.d2 J6.d3 J6.d6 J6.d7 J6.d10 J6.d13 J6.d16 J6.d19 J6.d22 J6.d25 J6.d28 J6.d37 J6.d39 J6.g1 J6.g4 J6.g5 J6.g8 J6.g11 J6.g14 J6.g17 J6.g20 J6.g23 J6.g26 J6.g29 J6.g32 J6.g35 J6.g38 J6.g40 J6.h2 J6.h3 J6.h6 J6.h9 J6.h12 J6.h15 J6.h18 J6.h21 J6.h24 J6.h27 J6.h30 J6.h33 J6.h36 J6.h39
P3V3: J6.c39 J6.d36 J6.d38 J6.d40
P3V3_AUX: J6.d32
P12V0: J6.c35 J6.c37
VADJ: J6.g39 J6.h40
CLK125_N: J6.g3 ; port CLK125_N
CLK125_P: J6.g2 ; port CLK125_P
DELAY_D0: J6.h38
DELAY_D1: J6.h37
DELAY_D2: J6.g37
DELAY_D3: J6.g36
DELAY_D4: J6.h35
DELAY_D5: J6.h34
DELAY_D6: J6.g34
DELAY_D7: J6.g33
DELAY_D8: J6.h32
DELAY_D9: J6.h31
DELAY_LEN1: J6.h28 ; port DELAY_LEN1
DELAY_LEN2: J6.h29 ; port DELAY_LEN2
DELAY_LEN3: J6.g31 ; port DELAY_LEN3
DELAY_LEN4: J6.g30 ; port DELAY_LEN4
DIN1: J6.h26 ; port DIN1
DIN2: J6.h25 ; port DIN2
DIN3: J6.g28 ; port DIN3
DIN4: J6.g27 ; port DIN4
EXT_CSn: J6.g21 ; port EXT_CSn
FPGA_TDC_START_N: J6.h5 ; port FPGA_TDC_START_N
FPGA_TDC_START_P: J6.h4 ; port FPGA_TDC_START_P
GA0: J6.c34 ; port GA0
GA1: J6.d35 ; port GA1
SCL: J6.c30 ; port SCL
SCLK: J6.d26 ; port PLL_SCLK
SDA: J6.c31 ; port SDA
SDI: J6.c26 ; port PLL_SDI
SDO: J6.c27 ; port PLL_SDO
TDC_ADR0: J6.c22
TDC_ADR1: J6.c23
TDC_ADR2: J6.h22
TDC_ADR3: J6.h23
TDC_CSN: J6.g22 ; port TDC_CSN
TDC_D0: J6.d9
TDC_D1: J6.h11
TDC_D2: J6.d8
TDC_D3: J6.h10
TDC_D4: J6.g10
TDC_D5: J6.g9
TDC_D6: J6.h8
TDC_D7: J6.h7
TDC_D8: J6.c10
TDC_D9: J6.c11
TDC_D10: J6.g12
TDC_D11: J6.g13
TDC_D12: J6.d11
TDC_D13: J6.d12
TDC_D14: J6.h13
TDC_D15: J6.h14
TDC_D16: J6.d14
TDC_D17: J6.d15
TDC_D18: J6.c14
TDC_D19: J6.c15
TDC_D20: J6.g15
TDC_D21: J6.g16
TDC_D22: J6.h16
TDC_D23: J6.h17
TDC_D24: J6.d17
TDC_D25: J6.d18
TDC_D26: J6.c18
TDC_D27: J6.c19
TDC_OEN: J6.d23 ; port TDC_OEN
TDC_RDN: J6.d21 ; port TDC_RDN
TDC_WRN: J6.d20 ; port TDC_WRN
TDI: J6.d30 J6.d31
TRIG_OUT_LVTTL: J6.g6 ; port TRIG_OUT_LVTTL
NetIC4_17: J6.d27 ; port PLL_CS
NetIC8_4: J6.g24 ; port TDC_START_DIS
NetIC8_5: J6.g25 ; port TDC_STOP_DIS
NetIC13_1: J6.h20 ; port ONEWIRE
NetIC14_5: J6.d24 ; port PLL_DAC_SYNC_N
NetIC17_1: J6.g7 ; port TRIG_FPGA
NetJ6_g18: J6.g18 ; port TDC_ALUTRIGGER
NetJ6_g19: J6.g19 ; port TDC_EMPTY_FLAG
NetJ6_h19: J6.h19 ; port TDC_ERR

Not connected (* = marked no-connect by the designer): J6 c2 c3 c6* c7* d1* d4* d5* d29* d33* d34* h1*

### Buses and harness runs
bus DELAY_D[9..0] = port DELAY_D[9..0]
bus TDC_ADR[3..0] = port TDC_ADR[3..0]
bus TDC_D[27..0] = port TDC_D[27..0]

### Layout directives
differential pair: CLK125_N, CLK125_P

### Notes on the sheet
- CC-ended lines are renamed, because Altium Designer treats only P and N ended line names as a differential pairs.
- (near J6) H
- VREF MUST BE 2.5V or 3.3V
- (near J6) G
- (near J6) D
- (near J6) C
- (near J6) TDO
- FTG1 ... FTG6
  Reference points for the component mounting machine.
- B1 ... B4
  screw holes for mounting the FmcAdc to the carrier board.
- Project/Equipment
- Document
- Designer
- Drawn by
- Check.by
- File
- Last Mod.
- Print Date
- Sheet
- Size
- A3
- of
- Rev

### Library data of the parts
B1-B4 = PLATED_HOLE3.0_PAD6.0: Single Terminal Socket; Part Description: Plated Through Hole: Hole Dia.=3.0mm Pad Dia.=6.0mm; Mounted: No; Table: Pads; Part Number: PLATED_HOLE3.0_PAD6.0; Component Kind: Standard (No BOM); Component Type: Standard (No BOM); Designator: Single Terminal Socket; Library Reference: Single Terminal Socket; Pin Count: 1; Family: Plated Hole; Socket: No; SMD: No; Status: None; ComponentHeight: 0mm; Author: CERN DEM JLC; CreateDate: 5/26/2008; LatestRevisionDate: 5/26/2008; PackageDescription: Plated Through Hole: Hole Dia.=3.0mm Pad Dia.=6.0mm
FTG1-FTG6 = FIDUCIAL_TARGET_S100-200: Fiducial Target; Part Description: Scare Fiducial Target, Top Layer, 1.0mm, Top Sloder 2.0mm, Keepout =2.0mm; Mounted: No; Table: Pads; Part Number: FIDUCIAL_TARGET_S100-200; Component Kind: Standard (No BOM); Component Type: Standard (No BOM); Pin Count: 1; Family: Fiducial; Socket: No; SMD: Yes; Status: None; ComponentHeight: 0mm; Author: CERN DEM JLC; CreateDate: 2/9/2010; LatestRevisionDate: 2/9/2010; PackageDescription: Scare Fiducial Target, Top Layer, 1.0mm, Top Sloder 2.0mm, Keepout =2.0mm
J6 = SAMTEC_ASP-127797-01: Connector VITA 57, 160 Male contacts in 4 row cdgh; Part Description: 160 contacts (4 rows cdgh) Surface Mount Male Connector, VITA 57; Manufacturer: SAMTEC; Manufacturer Part Number: ASP-134488-01; Part Number: SAMTEC_ASP-127797-01; Component Kind: Standard; Component Type: Standard; Pin Count: 160; Family: VITA 57; Mounted: Yes; Socket: No; SMD: Yes; Status: None; ComponentHeight: 6.1mm; HelpURL: \\cern.ch\dfs\Applications\Altium\Datasheets\SAMTEC_ASP-127797-01.pdf; Author: CERN DEM JLC; CreateDate: 9/24/2009; LatestRevisionDate: 9/24/2009; Table: SAMTEC

## Sheet power_supply.SchDoc: Power supply & supervisor
size 297 x 209 mm; CheckedBy: -; CompanyName: CERN; DrawnBy: GK; Organization: CERN; Address1: European Organization for Nuclear Research; Address2: CH-1211 Geneve 23 - Switzerland; DocumentNumber: 10; Revision: -; SheetNumber: 5; SheetTotal: 9; EDA_Number: EDA-02667-V2-0; Projet: FMC Delay 1ns 4cha; ModifiedBy: -; CheckedDate: -; Title2: -; DivGrp: BE-CO; Designer: GK; ModifiedDate: -
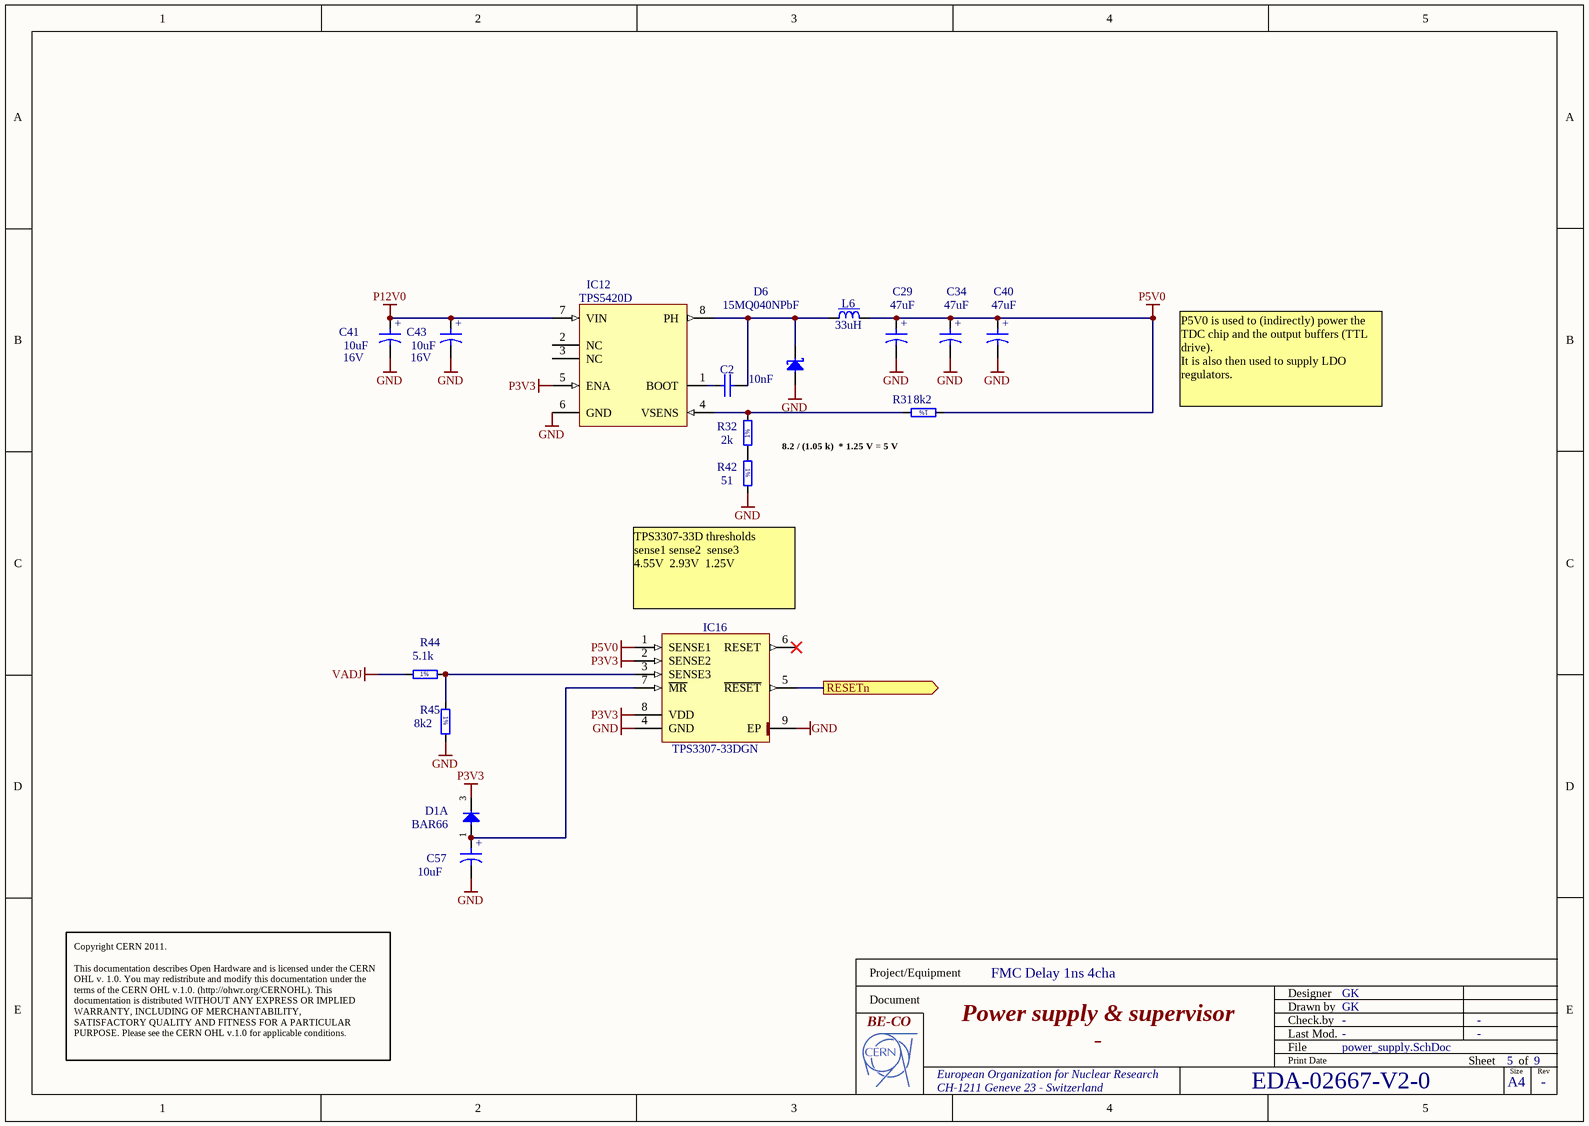
[diagram p3: power_supply.SchDoc]

### Parts
(Parts that share a designator on the sheet are numbered #1, #2 ... from top to bottom, then left to right.)
C2  10nF  [CAPC1608X87N]
C29  47uF  [CAPMP3528X210N]
C34  47uF  [CAPMP3528X210N]
C40  47uF  [CAPMP3528X210N]
C41  10uF  Voltage: 16V  [CAPMP3528X210N]
C43  10uF  Voltage: 16V  [CAPMP3528X210N]
C57  10uF  [CAPMP3216X180N]
D1  BAR66  [SOT95P240X110-3N]  (part A of 2)
D6  15MQ040NPbF  [DIOM5027X244N]
IC12  TPS5420D  [SOIC127P600X175-8N]
IC16  TPS3307-33DGN  [SOP65P490X110-9N-R157X189]
L6  33uH  [IND_MURATA-PS_4500]
R31#1  8k2  [RESC1608X55N]
R32#1  2k  [RESC1608X55N]
R42  51  [RESC1608X55N]
R44  5.1k  [RESC1608X55N]
R45  8k2  [RESC1608X55N]

### Ports
RESETn (out)

### Nets
GND: C29.2 C34.2 C40.2 C41.2 C43.2 C57.2 D6.2(A) IC12.6(GND) IC16.4(GND) IC16.9(EP) R42.2 R45.2
P3V3: D1.3(COMAC) IC12.5(ENA) IC16.2(SENSE2) IC16.8(VDD)
P5V0: C29.1 C34.1 C40.1 IC16.1(SENSE1) L6.2 R31#1.1
P12V0: C41.1 C43.1 IC12.7(VIN)
VADJ: R44.1
RESETn: IC16.5(~{RESET}) ; port RESETn
NetC2_1: C2.1 IC12.1(BOOT)
NetC2_2: C2.2 D6.1(C) IC12.8(PH) L6.1
NetC57_1: C57.1 D1.1(A) IC16.7(~{MR})
NetIC12_4: IC12.4(VSENS) R31#1.2 R32#1.2
NetIC16_3: IC16.3(SENSE3) R44.2 R45.1
NetR32#1_1: R32#1.1 R42.1

Not connected (* = marked no-connect by the designer): IC12 2(NC) 3(NC); IC16 6(RESET)*

### Notes on the sheet
- P5V0 is used to (indirectly) power the TDC chip and the output buffers (TTL drive).
  It is also then used to supply LDO regulators.
- 8.2 / (1.05 k)  * 1.25 V = 5 V
- TPS3307-33D thresholds
  sense1	sense2 	sense3
  4.55V 	2.93V 	1.25V
- Copyright CERN 2011.
  This documentation describes Open Hardware and is licensed under the CERN OHL v. 1.0. You may redistribute and modify this documentation under the terms of the CERN OHL v.1.0. (http://ohwr.org/CERNOHL). This documentation is distributed WITHOUT ANY EXPRESS OR IMPLIED WARRANTY, INCLUDING OF MERCHANTABILITY, SATISFACTORY QUALITY AND FITNESS FOR A PARTICULAR PURPOSE. Please see the CERN OHL v.1.0 for applicable conditions.
- Project/Equipment
- Document
- Designer
- Drawn by
- Check.by
- File
- Last Mod.
- Print Date
- Sheet
- Size
- A4
- of
- Rev
- (in symbol CTE3216-18_10UF_10V_10%_LESR1800) +
- (in symbol CTE3528-21_10UF_16V_10%_LESR0800) +
- (in symbol CTE3528-21_47UF_6.3V_10%_LESR0250) +
- (in symbol R0603_2K_1%_0.1W_100PPM) 1%
- (in symbol R0603_5K1_1%_0.1W_100PPM) 1%
- (in symbol R0603_8K2_1%_0.1W_100PPM) 1%
- (in symbol R0603_51R_1%_0.1W_100PPM) 1%

### Library data of the parts
C2 = CC0603_10NF_50V_10%_X7R: as C10 on sheet clock_generator; Part Number: CC0603_10NF_50V_10%_X7R; Component Kind: Standard; Component Type: Standard; Pin Count: 2; Value: 10nF; Status: Preferred; Manufacturer Part Number: CC0603_10NF_50V_10%_X7R; Case: 0603; Mounted: Yes; Socket: No; SMD: Yes; Manufacturer1 Example: PHYCOMP; Manufacturer1 ComponentHeight: 0.87mm; HelpURL: \\cern.ch\dfs\Applications\Altium\Datasheets\CC0603_X7R_PHYCOMP.pdf; Author: CERN DEM JLC; CreateDate: 12/3/2007; LatestRevisionDate: 12/3/2007
C29 C34 C40 = CTE3528-21_47UF_6.3V_10%_LESR0250: Polarised capacitor; Part Description: Low ESR 0R25 Solid Tantalum Chip Capacitor; Manufacturer: GENERIC; Manufacturer1 Part Number: TPSB476K006R0250; Voltage: 6.3V; Tolerance: ±10%; Table: Capacitors SMD; Part Number: CTE3528-21_47UF_6.3V_10%_LESR0250; Component Kind: Standard; Component Type: Standard; Pin Count: 2; Value: 47uF; Status: Preferred; Manufacturer Part Number: CTE3528-21_47UF_6.3V_10%_LESR0250; Case: B; Mounted: Yes; Socket: No; SMD: Yes; Manufacturer1 Example: AVX; Manufacturer1 ComponentHeight: 2.1mm; HelpURL: \\cern.ch\dfs\Applications\Altium\Datasheets\CTE-LESR_AVX_TPS.pdf; Author: CERN DEM JLC; CreateDate: 5/5/2008; LatestRevisionDate: 1/20/2009
C41 C43 = CTE3528-21_10UF_16V_10%_LESR0800: Polarised capacitor; Part Description: Low ESR 0R8 Solid Tantalum Chip Capacitor; Manufacturer: GENERIC; Manufacturer1 Part Number: TPSB106K016R0800; Tolerance: ±10%; Table: Capacitors SMD; Part Number: CTE3528-21_10UF_16V_10%_LESR0800; Component Kind: Standard; Component Type: Standard; Pin Count: 2; Value: 10uF; Status: Preferred; Manufacturer Part Number: CTE3528-21_10UF_16V_10%_LESR0800; Case: B; Mounted: Yes; Socket: No; SMD: Yes; Manufacturer1 Example: AVX; Manufacturer1 ComponentHeight: 2.1mm; HelpURL: \\cern.ch\dfs\Applications\Altium\Datasheets\CTE-LESR_AVX_TPS.pdf; Author: CERN DEM JLC; CreateDate: 5/5/2008; LatestRevisionDate: 1/20/2009
C57 = CTE3216-18_10UF_10V_10%_LESR1800: as C16 on sheet clock_generator; Part Number: CTE3216-18_10UF_10V_10%_LESR1800; Component Kind: Standard; Component Type: Standard; Pin Count: 2; Value: 10uF; Status: Preferred; Manufacturer Part Number: CTE3216-18_10UF_10V_10%_LESR1800; Case: A; Mounted: Yes; Socket: No; SMD: Yes; Manufacturer1 Example: AVX; Manufacturer1 ComponentHeight: 1.8mm; HelpURL: \\cern.ch\dfs\Applications\Altium\Datasheets\CTE-LESR_AVX_TPS.pdf; Author: CERN DEM JLC; CreateDate: 5/5/2008; LatestRevisionDate: 1/20/2009
D1 = BAR66: Serial Diode; Part Description: Silicon PIN Diode Array (Series Connected); Manufacturer: INFINEON; Voltage: 150V; Power: 250mA; Table: Diodes; Part Number: BAR66; Component Kind: Standard; Component Type: Standard; Device: BAR66; PackageDescription: SOT23 3-Leads, Pitch 0.95mm - Body 1.3x2.9mm, IPC Medium Density; Manufacturer Part Number: BAR66; Pin Count: 3; Case: SOT23; Mounted: Yes; Socket: No; SMD: Yes; ComponentHeight: 1.1mm; HelpURL: \\cern.ch\dfs\Applications\Altium\Datasheets\BAR66.pdf; Author: CERN DEM JLC; CreateDate: 1/18/2010; LatestRevisionDate: 10/5/2010
D6 = 15MQ040NPbF: Schottky Diode; Part Description: Schottky Rectifier; Manufacturer: VISHAY INTERTECHNOLOGY, INC.; Voltage: 40V; Power: 3A; Table: Diodes; Part Number: 15MQ040NPbF; Component Kind: Standard; Component Type: Standard; Device: 15MQ040NPbF; PackageDescription: DO-214-AC/SMA  Molded Diode, Body 5.0x2.7mm, IPC Medium Density; Manufacturer Part Number: 15MQ040NPbF; Pin Count: 2; Case: DO-214AC; Mounted: Yes; Socket: No; SMD: Yes; ComponentHeight: 2.44mm; HelpURL: \\cern.ch\dfs\Applications\Altium\Datasheets\15MQ040NPbF.pdf; Author: CERN DEM JLC; CreateDate: 3/9/2009; LatestRevisionDate: 3/9/2009
IC12 = TPS5420D: 2A, Wide Input Range, Step-Down SWIFT Converter; Manufacturer: TEXAS INSTRUMENTS; Table: DC-DC Converters; Part Number: TPS5420D; Component Kind: Standard; Component Type: Standard; Device: TPS5420D; PackageDescription: SOIC 8, Pitch 1.27mm - Body 4x5mm, IPC Medium Density; Part Description: 2A, Wide Input Range, Step-Down SWIFT Converter; Manufacturer Part Number: TPS5420D; Pin Count: 8; Case: SOIC8; Mounted: Yes; Socket: No; SMD: Yes; ComponentHeight: 1.75mm; HelpURL: \\cern.ch\dfs\Applications\Altium\Datasheets\TPS5420D.pdf; Author: CERN DEM JLC; CreateDate: 11/17/2009; LatestRevisionDate: 11/17/2009
IC16 = TPS3307-33DGN: Triple Processor Supervisors; Manufacturer: TEXAS INSTRUMENTS; Table: Analog & Interface; Part Number: TPS3307-33DGN; Component Kind: Standard; Component Type: Standard; Device: TPS3307-33DGN; PackageDescription: SOP,0.65mm,pitch; 8 pin,3.00mm W X 3.00mm L X 1.10mm H body (w/thermal tab 1.57 X 1.89 mm), IPC Medium Density; Part Description: Triple Processor Supervisors; Manufacturer Part Number: TPS3307-33DGN; Pin Count: 9; Case: TSSOP8; Mounted: Yes; Socket: No; SMD: Yes; ComponentHeight: 1.1mm; Author: CERN DEM JLC; HelpURL: \\cern.ch\dfs\Applications\Altium\Datasheets\TPS3307-33DGN.pdf; CreateDate: 1/10/2011; LatestRevisionDate: 1/10/2011
L6 = IND_33UH_20%_MURATA-PS_4500: Inductor With Magnetic core; Part Description: Shielded Surface Mount Power Inductors (4500 Serie); Manufacturer: MURATA; Manufacturer Part Number: 45333C; Power: 1.25A; Resistance: 0.25R; Tolerance: ±20%; Table: Inductors SMD; Part Number: IND_33UH_20%_MURATA-PS_4500; Component Kind: Standard; Component Type: Standard; Pin Count: 2; Value: 33uH; Status: None; Mounted: Yes; Socket: No; SMD: Yes; ComponentHeight: 3.55mm; HelpURL: \\cern.ch\dfs\Applications\Altium\Datasheets\IND_MURATA-PS_4500.pdf; Author: CERN DEM JLC; CreateDate: 1/10/2011; LatestRevisionDate: 1/10/2011
R31#1 R45 = R0603_8K2_1%_0.1W_100PPM: Resistor - 1%; Part Description: General Purpose Thick Film Chip Resistor; Manufacturer: GENERIC; Manufacturer1 Part Number: NRC06F8201TRF; Power: 0.1W; TC: ±100ppm/°C; Table: Resistors SMD; Part Number: R0603_8K2_1%_0.1W_100PPM; Component Kind: Standard; Component Type: Standard; Pin Count: 2; Value: 8k2; Status: Preferred; Tolerance: ±1%; Manufacturer Part Number: R0603_8K2_1%_0.1W_100PPM; Case: 0603; Mounted: Yes; Socket: No; SMD: Yes; Manufacturer1 Example: NIC COMPONENT; Manufacturer1 ComponentHeight: 0.55mm; HelpURL: \\cern.ch\dfs\Applications\Altium\Datasheets\R0603_NIC_NRC.pdf; Author: CERN DEM JLC; CreateDate: 12/3/2007; LatestRevisionDate: 3/13/2008
R32#1 = R0603_2K_1%_0.1W_100PPM: Resistor - 1%; Part Description: General Purpose Thick Film Chip Resistor; Manufacturer: GENERIC; Manufacturer1 Part Number: NRC06F2001TRF; Power: 0.1W; TC: ±100ppm/°C; Table: Resistors SMD; Part Number: R0603_2K_1%_0.1W_100PPM; Component Kind: Standard; Component Type: Standard; Pin Count: 2; Value: 2k; Status: Preferred; Tolerance: ±1%; Manufacturer Part Number: R0603_2K_1%_0.1W_100PPM; Case: 0603; Mounted: Yes; Socket: No; SMD: Yes; Manufacturer1 Example: NIC COMPONENT; Manufacturer1 ComponentHeight: 0.55mm; HelpURL: \\cern.ch\dfs\Applications\Altium\Datasheets\R0603_NIC_NRC.pdf; Author: CERN DEM JLC; CreateDate: 12/3/2007; LatestRevisionDate: 3/13/2008
R42 = R0603_51R_1%_0.1W_100PPM: as R68 on sheet FMC_Delay_1ns_4Cha; Part Number: R0603_51R_1%_0.1W_100PPM; Component Kind: Standard; Component Type: Standard; Pin Count: 2; Value: 51; Status: Preferred; Tolerance: ±1%; Manufacturer Part Number: R0603_51R_1%_0.1W_100PPM; Case: 0603; Mounted: Yes; Socket: No; SMD: Yes; Manufacturer1 Example: NIC COMPONENT; Manufacturer1 ComponentHeight: 0.55mm; HelpURL: \\cern.ch\dfs\Applications\Altium\Datasheets\R0603_NIC_NRC.pdf; Author: CERN DEM JLC; CreateDate: 12/3/2007; LatestRevisionDate: 3/13/2008
R44 = R0603_5K1_1%_0.1W_100PPM: as R36 on sheet clock_generator; Part Number: R0603_5K1_1%_0.1W_100PPM; Component Kind: Standard; Component Type: Standard; Designator: Resistor - 1%; Library Reference: Resistor - 1%; Pin Count: 2; Status: Preferred; Tolerance: ±1%; Manufacturer Part Number: R0603_5K1_1%_0.1W_100PPM; Case: 0603; Mounted: Yes; Socket: No; SMD: Yes; Manufacturer1 Example: NIC COMPONENT; Manufacturer1 ComponentHeight: 0.55mm; HelpURL: \\cern.ch\dfs\Applications\Altium\Datasheets\R0603_NIC_NRC.pdf; Author: CERN DEM JLC; CreateDate: 12/3/2007; LatestRevisionDate: 3/13/2008